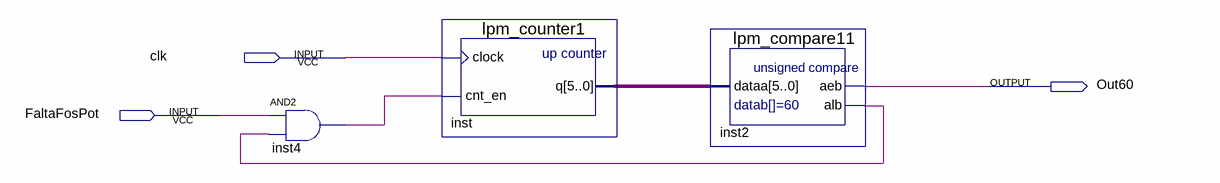
[diagram p0: schematic sheet]
// Quartus schematic count60.bdf as structural Verilog: 3 symbols, 3 pins
module count60 (
  input  clk,
  input  FaltaFosPot,
  output Out60
);

  wire inst2_alb, inst4_out;
  wire [5:0] inst_q;

  and inst4 (inst4_out, FaltaFosPot, inst2_alb);
  lpm_counter1 inst (.clock(clk), .cnt_en(inst4_out), .q(inst_q));
  lpm_compare11 inst2 (.dataa(inst_q), .aeb(Out60), .alb(inst2_alb));
endmodule
